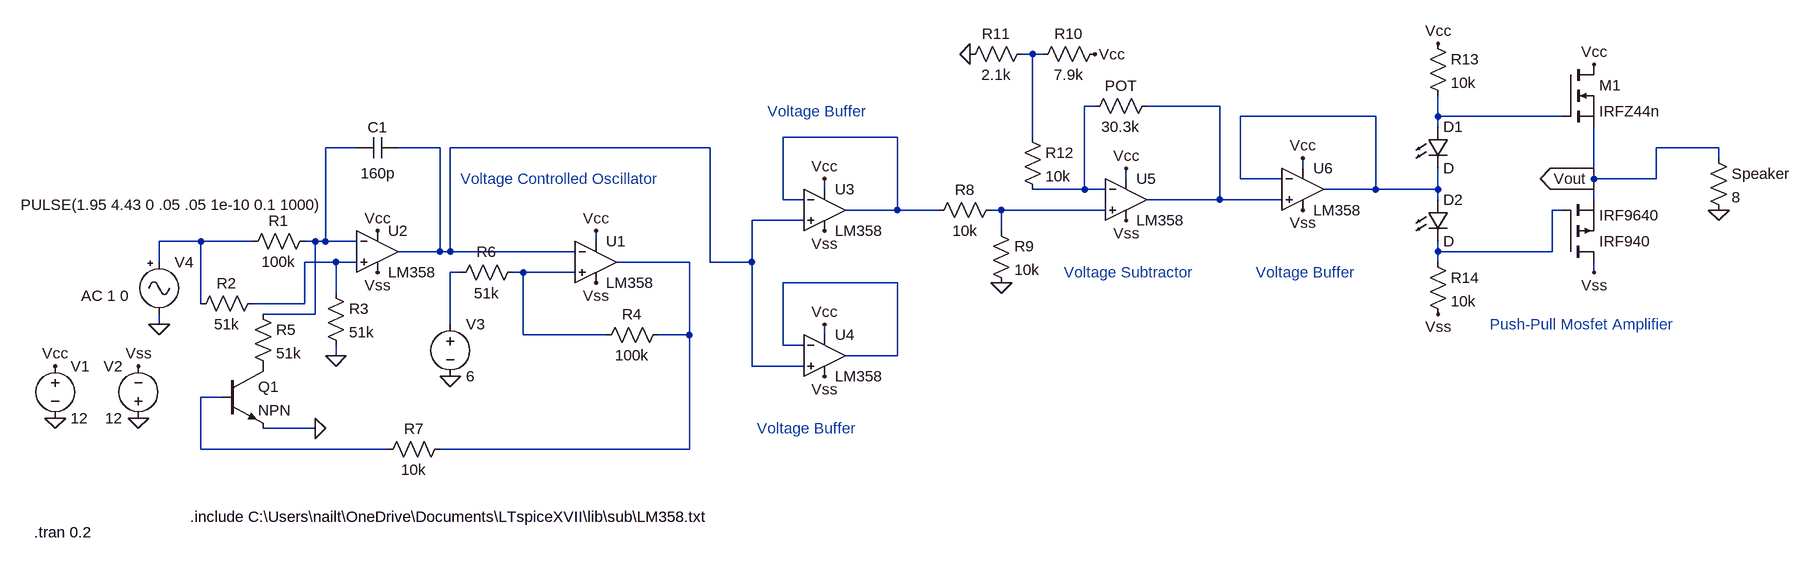
[diagram p0: schematic Transmitter.asc]
Transmitter.asc, the LTspice schematic file:
Version 4
SHEET 1 2324 680
WIRE 1152 -288 1136 -288
WIRE 1168 -288 1152 -288
WIRE 1248 -208 1232 -208
WIRE 1440 -208 1328 -208
WIRE 1680 -192 1472 -192
WIRE 1776 -192 1776 -224
WIRE 1968 -192 1776 -192
WIRE 1776 -176 1776 -192
WIRE 944 -160 768 -160
WIRE 1152 -160 1152 -288
WIRE 112 -144 64 -144
WIRE 240 -144 176 -144
WIRE 656 -144 256 -144
WIRE 2208 -144 2112 -144
WIRE 2208 -128 2208 -144
WIRE 1568 -112 1568 -128
WIRE 1296 -96 1296 -112
WIRE 1472 -96 1472 -192
WIRE 1536 -96 1472 -96
WIRE 2016 -96 2016 -176
WIRE 2112 -96 2112 -144
WIRE 2112 -96 2016 -96
WIRE 832 -80 832 -96
WIRE 1232 -80 1232 -208
WIRE 1232 -80 1152 -80
WIRE 1264 -80 1232 -80
WIRE 1680 -80 1680 -192
WIRE 1680 -80 1600 -80
WIRE 1776 -80 1776 -112
WIRE 1776 -80 1680 -80
WIRE 768 -64 768 -160
WIRE 800 -64 768 -64
WIRE 1440 -64 1440 -208
WIRE 1440 -64 1328 -64
WIRE 1536 -64 1440 -64
WIRE 1776 -64 1776 -80
WIRE 2016 -64 2016 -96
WIRE 944 -48 944 -160
WIRE 944 -48 864 -48
WIRE 1008 -48 944 -48
WIRE 1104 -48 1088 -48
WIRE 1264 -48 1104 -48
WIRE 1968 -48 1952 -48
WIRE 800 -32 720 -32
WIRE 1104 -16 1104 -48
WIRE -128 0 -192 0
WIRE -48 0 -128 0
WIRE 48 0 32 0
WIRE 64 0 64 -144
WIRE 64 0 48 0
WIRE 112 0 64 0
WIRE 480 0 480 -16
WIRE 240 16 240 -144
WIRE 240 16 176 16
WIRE 256 16 256 -144
WIRE 256 16 240 16
WIRE 448 16 256 16
WIRE 1776 16 1776 0
WIRE 1952 16 1952 -48
WIRE 1952 16 1776 16
WIRE -192 32 -192 0
WIRE 80 32 32 32
WIRE 112 32 80 32
WIRE 624 32 512 32
WIRE 656 32 656 -144
WIRE 720 32 720 -32
WIRE 720 32 656 32
WIRE 1776 32 1776 16
WIRE 272 48 256 48
WIRE 368 48 352 48
WIRE 448 48 368 48
WIRE 2016 48 2016 32
WIRE 944 64 768 64
WIRE 80 80 80 32
WIRE -128 96 -128 0
WIRE 32 96 32 32
WIRE 32 96 -48 96
WIRE 48 112 48 0
WIRE 48 112 -32 112
WIRE -192 128 -192 112
WIRE 256 128 256 48
WIRE 368 144 368 48
WIRE 496 144 368 144
WIRE 624 144 624 32
WIRE 624 144 576 144
WIRE 832 144 832 128
WIRE 768 160 768 64
WIRE 800 160 768 160
WIRE 80 176 80 160
WIRE 944 176 944 64
WIRE 944 176 864 176
WIRE 720 192 720 32
WIRE 800 192 720 192
WIRE -96 240 -128 240
WIRE 48 288 -32 288
WIRE -128 320 -128 240
WIRE 160 320 -128 320
WIRE 624 320 624 144
WIRE 624 320 240 320
FLAG -352 192 Vcc
FLAG -224 192 Vss
FLAG 144 -16 Vcc
FLAG 144 48 Vss
FLAG 80 176 0
FLAG 48 288 0
FLAG -352 272 0
FLAG -224 272 0
FLAG 480 -16 Vcc
FLAG 480 64 Vss
FLAG 256 208 0
FLAG -192 128 0
FLAG 832 -96 Vcc
FLAG 832 -16 Vss
FLAG 832 128 Vcc
FLAG 832 208 Vss
FLAG 1296 -112 Vcc
FLAG 1296 -32 Vss
FLAG 1104 64 0
FLAG 1248 -288 Vcc
FLAG 1056 -288 0
FLAG 1568 -128 Vcc
FLAG 1568 -48 Vss
FLAG 2016 48 Vss
FLAG 2016 -272 Vcc
FLAG 1776 -304 Vcc
FLAG 1776 112 Vss
FLAG 2208 -48 0
FLAG 2016 -96 Vout
IOPIN 2016 -96 Out
SYMBOL voltage -352 176 R0
WINDOW 123 0 0 Left 2
WINDOW 39 0 0 Left 2
SYMATTR InstName V1
SYMATTR Value 12
SYMBOL voltage -224 288 R180
WINDOW 0 24 96 Left 2
WINDOW 3 24 16 Left 2
WINDOW 123 0 0 Left 2
WINDOW 39 0 0 Left 2
SYMATTR InstName V2
SYMATTR Value 12
SYMBOL res 48 -16 R90
WINDOW 0 0 56 VBottom 2
WINDOW 3 32 56 VTop 2
SYMATTR InstName R1
SYMATTR Value 100k
SYMBOL res -32 80 R90
WINDOW 0 0 56 VBottom 2
WINDOW 3 32 56 VTop 2
SYMATTR InstName R2
SYMATTR Value 51k
SYMBOL res 64 64 R0
SYMATTR InstName R3
SYMATTR Value 51k
SYMBOL res 592 128 R90
WINDOW 0 0 56 VBottom 2
WINDOW 3 32 56 VTop 2
SYMATTR InstName R4
SYMATTR Value 100k
SYMBOL cap 176 -160 R90
WINDOW 0 0 32 VBottom 2
WINDOW 3 40 31 VTop 2
SYMATTR InstName C1
SYMATTR Value 160p
SYMBOL res -48 96 R0
SYMATTR InstName R5
SYMATTR Value 51k
SYMBOL voltage 256 112 R0
WINDOW 123 0 0 Left 2
WINDOW 39 0 0 Left 2
SYMATTR InstName V3
SYMATTR Value 6
SYMBOL res 368 32 R90
WINDOW 0 0 56 VBottom 2
WINDOW 3 32 56 VTop 2
SYMATTR InstName R6
SYMATTR Value 51k
SYMBOL res 256 304 R90
WINDOW 0 0 56 VBottom 2
WINDOW 3 32 56 VTop 2
SYMATTR InstName R7
SYMATTR Value 10k
SYMBOL Misc\\signal -192 16 R0
WINDOW 123 -120 68 Left 2
WINDOW 39 0 0 Left 2
WINDOW 3 -213 -72 Left 2
SYMATTR Value2 AC 1 0
SYMATTR Value PULSE(1.95 4.43 0 .05 .05 1e-10 0.1 1000)
SYMATTR InstName V4
SYMBOL npn -96 192 R0
SYMATTR InstName Q1
SYMBOL Opamps\\opamp2 144 -48 R0
SYMATTR InstName U2
SYMATTR Value LM358
SYMBOL Opamps\\opamp2 480 -32 R0
SYMATTR InstName U1
SYMATTR Value LM358
SYMBOL Opamps\\opamp2 832 -112 R0
SYMATTR InstName U3
SYMATTR Value LM358
SYMBOL Opamps\\opamp2 832 112 R0
SYMATTR InstName U4
SYMATTR Value LM358
SYMBOL Opamps\\opamp2 1296 -128 R0
SYMATTR InstName U5
SYMATTR Value LM358
SYMBOL res 1104 -64 R90
WINDOW 0 0 56 VBottom 2
WINDOW 3 32 56 VTop 2
SYMATTR InstName R8
SYMATTR Value 10k
SYMBOL res 1344 -224 R90
WINDOW 0 0 56 VBottom 2
WINDOW 3 32 56 VTop 2
SYMATTR InstName POT
SYMATTR Value 30.3k
SYMBOL res 1088 -32 R0
SYMATTR InstName R9
SYMATTR Value 10k
SYMBOL res 1264 -304 R90
WINDOW 0 0 56 VBottom 2
WINDOW 3 32 56 VTop 2
SYMATTR InstName R10
SYMATTR Value 7.9k
SYMBOL res 1152 -304 R90
WINDOW 0 0 56 VBottom 2
WINDOW 3 32 56 VTop 2
SYMATTR InstName R11
SYMATTR Value 2.1k
SYMBOL res 1136 -176 R0
SYMATTR InstName R12
SYMATTR Value 10k
SYMBOL Opamps\\opamp2 1568 -144 R0
SYMATTR InstName U6
SYMATTR Value LM358
SYMBOL res 1760 -320 R0
SYMATTR InstName R13
SYMATTR Value 10k
SYMBOL LED 1760 -176 R0
SYMATTR InstName D1
SYMBOL LED 1760 -64 R0
SYMATTR InstName D2
SYMBOL res 1760 16 R0
SYMATTR InstName R14
SYMATTR Value 10k
SYMBOL res 2192 -144 R0
SYMATTR InstName Speaker
SYMATTR Value 8
SYMBOL pmos 1968 32 M180
SYMATTR InstName IRF940
SYMATTR Value IRF9640
SYMBOL nmos 1968 -272 R0
SYMATTR InstName M1
SYMATTR Value IRFZ44n
TEXT -144 424 Left 2 !.include C:\\Users\\nailt\\OneDrive\\Documents\\LTspiceXVII\\lib\\sub\\LM358.txt
TEXT 272 -96 Left 2 ;Voltage Controlled Oscillator
TEXT -384 448 Left 2 !.tran 0.2
TEXT 728 288 Left 2 ;Voltage Buffer
TEXT 744 -200 Left 2 ;Voltage Buffer
TEXT 1200 48 Left 2 ;Voltage Subtractor
TEXT 1496 48 Left 2 ;Voltage Buffer
TEXT 1856 128 Left 2 ;Push-Pull Mosfet Amplifier

The netlist it stands for:
* Transmitter.asc
V1 Vcc 0 12
V2 0 Vss 12
R1 N007 N011 100k
R2 N012 N011 51k
R3 N012 0 51k
R4 N013 N015 100k
C1 N008 N007 160p
R5 N007 P001 51k
V3 N014 0 6
R6 N015 N014 51k
R7 N013 N017 10k
V4 N011 0 PULSE(1.95 4.43 0 .05 .05 1e-10 0.1 1000) AC 1 0
Q1 P001 N017 0 0 NPN
XU2 N012 N007 Vcc Vss N008 LM358  ; pins In+ In- V+ V- OUT
XU1 N015 N008 Vcc Vss N013 LM358  ; pins In+ In- V+ V- OUT
XU3 N008 N006 Vcc Vss N006 LM358  ; pins In+ In- V+ V- OUT
XU4 N008 N016 Vcc Vss N016 LM358  ; pins In+ In- V+ V- OUT
XU5 N009 N002 Vcc Vss N003 LM358  ; pins In+ In- V+ V- OUT
R8 N009 N006 10k
R§POT N003 N002 30.3k
R9 N009 0 10k
R10 Vcc N001 7.9k
R11 N001 0 2.1k
R12 N001 N002 10k
XU6 N003 N004 Vcc Vss N004 LM358  ; pins In+ In- V+ V- OUT
R13 Vcc N005 10k
D1 N005 N004 D
D2 N004 N010 D
R14 N010 Vss 10k
R§Speaker Vout 0 8
M§IRF940 Vss N010 Vout Vout IRF9640
M1 Vcc N005 Vout Vout IRFZ44n
.model D D
.lib standard.dio
.model NPN NPN
.model PNP PNP
.lib standard.bjt
.model NMOS NMOS
.model PMOS PMOS
.lib standard.mos
.include C:\Users\nailt\OneDrive\Documents\LTspiceXVII\lib\sub\LM358.txt
* Voltage Controlled Oscillator
.tran 0.2
* Voltage Buffer
* Voltage Buffer
* Voltage Subtractor
* Voltage Buffer
* Push-Pull Mosfet Amplifier
.backanno
.end